# Altium schematic sheet PG12_CURRENT_INTEGRATION.SchDoc: BMU - Current Monitor
size B; Address1: 3511 EDISON WAY; Address2: MENLO PARK, CA, 94025; DocumentNumber: 1; Revision: 4.1; SheetNumber: 7; SheetTotal: 9
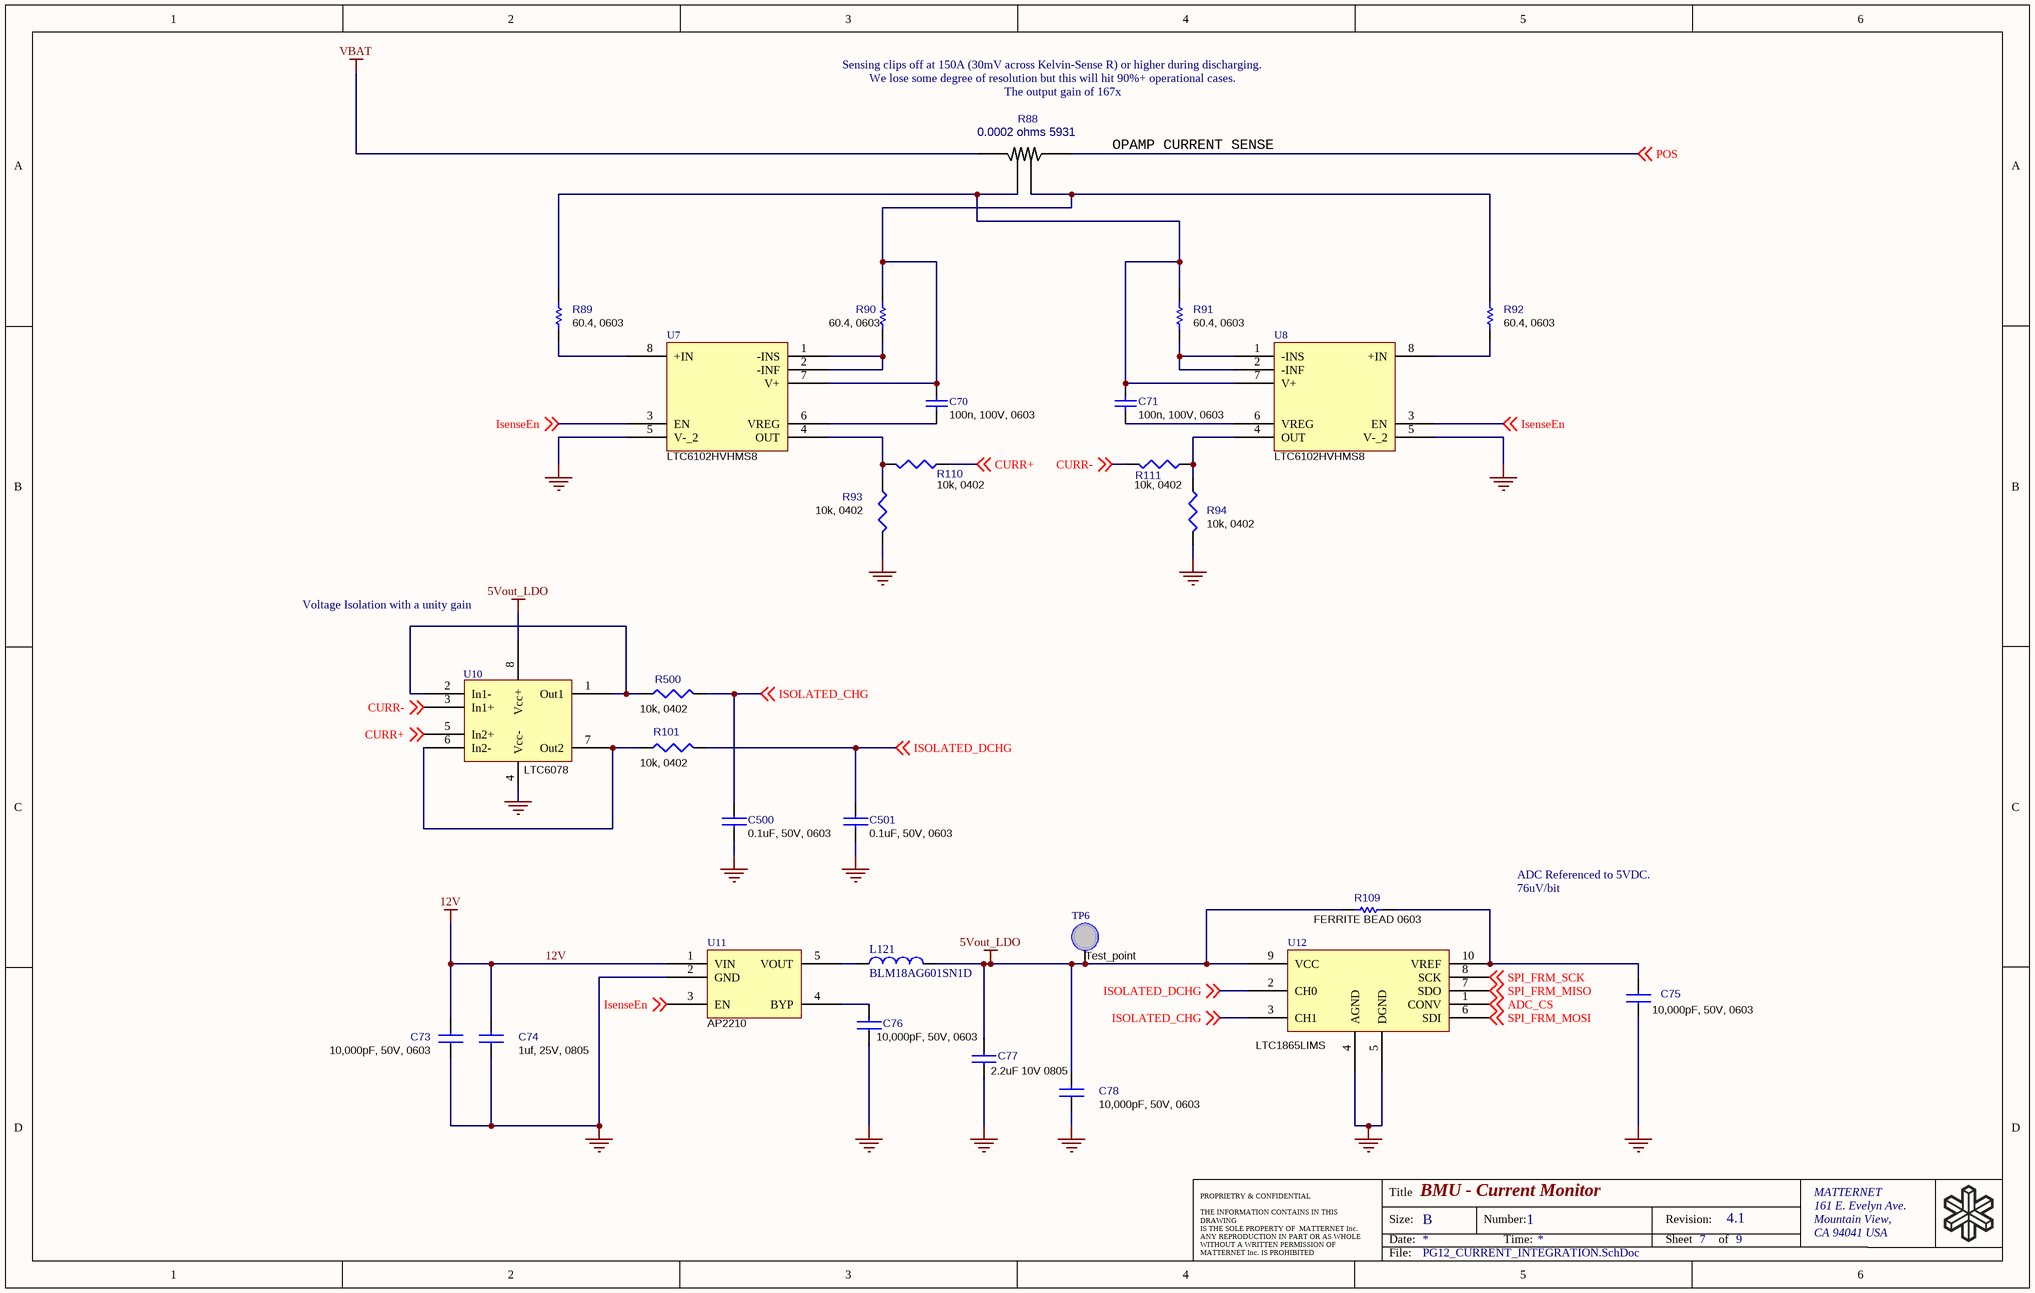
[diagram p0: PG12_CURRENT_INTEGRATION.SchDoc]

## Parts
C70  100n, 100V, 0603  [C0603]
C71  100n, 100V, 0603  [C0603]
C73  10,000pF, 50V, 0603  [C0603]
C74  1uf, 25V, 0805  [C0805]
C75  10,000pF, 50V, 0603  [C0603]
C76  10,000pF, 50V, 0603  [C0603]
C77  2.2uF 10V 0805  [C0805]
C78  10,000pF, 50V, 0603  [C0603]
C500  0.1uF, 50V, 0603  [C0603]
C501  0.1uF, 50V, 0603  [C0603]
L121  BLM18AG601SN1D  [INDC1608X10N]
R88  WSL2512R0700FEA  [R5931]  (value not drawn)
R89  60.4, 0603  [R0603]
R90  60.4, 0603  [R0603]
R91  60.4, 0603  [R0603]
R92  60.4, 0603  [R0603]
R93  10k, 0402  [R0402]
R94  10k, 0402  [R0402]
R101  10k, 0402  [R0402]
R109  FERRITE BEAD 0603  [R0603]
R110  10k, 0402  [R0402]
R111  10k, 0402  [R0402]
R500  10k, 0402  [R0402]
TP6  Test_point  [TP]  (no BOM)
U7  LTC6102HVHMS8  [8MSOP]
U8  LTC6102HVHMS8  [8MSOP]
U10  LTC6078  [8MSOP]
U11  AP2210  [SOT23-5]
U12  LTC1865LIMS  [10-MSOP]

## Nets
5Vout_LDO: C77.2 C78.2 L121.2 R109.2 TP6.1 U10.8(Vcc+) U12.9(VCC)
12V: C73.2 C74.2 U11.1(VIN)
GND: C73.1 C74.1 C75.1 C76.1 C77.1 C78.1 C500.2 C501.2 R93.2 R94.2 U7.5(V-_2) U8.5(V-_2) U10.4(Vcc-) U11.2(GND) U12.4(AGND) U12.5(DGND)
VBAT: R88.1
ADC_CS: U12.1(CONV) ; off-sheet ADC_CS
CURR+: R110.1 U10.5(In2+) ; off-sheet CURR+
CURR-: R111.2 U10.3(In1+) ; off-sheet CURR-
IsenseEn: U7.3(EN) U8.3(EN) U11.3(EN) ; off-sheet IsenseEn
ISOLATED_CHG: C500.1 R500.2 U12.3(CH1) ; off-sheet ISOLATED_CHG
ISOLATED_DCHG: C501.1 R101.2 U12.2(CH0) ; off-sheet ISOLATED_DCHG
POS: R88.2 ; off-sheet POS
SPI_FRM_MISO: U12.7(SDO) ; off-sheet SPI_FRM_MISO
SPI_FRM_MOSI: U12.6(SDI) ; off-sheet SPI_FRM_MOSI
SPI_FRM_SCK: U12.8(SCK) ; off-sheet SPI_FRM_SCK
NetC70_1: C70.1 U7.6(VREG)
NetC70_2: C70.2 R88.4 R90.2 R92.2 U7.7(V+)
NetC71_1: C71.1 U8.6(VREG)
NetC71_2: C71.2 R88.3 R89.2 R91.2 U8.7(V+)
NetC75_2: C75.2 R109.1 U12.10(VREF)
NetC76_2: C76.2 U11.4(BYP)
NetL121_1: L121.1 U11.5(VOUT)
NetR89_1: R89.1 U7.8(+IN)
NetR90_1: R90.1 U7.1(-INS) U7.2(-INF)
NetR91_1: R91.1 U8.1(-INS) U8.2(-INF)
NetR92_1: R92.1 U8.8(+IN)
NetR93_1: R93.1 R110.2 U7.4(OUT)
NetR94_1: R94.1 R111.1 U8.4(OUT)
NetR101_1: R101.1 U10.6(In2-) U10.7(Out2)
NetR500_1: R500.1 U10.1(Out1) U10.2(In1-)

## Notes on the sheet
- Sensing clips off at 150A (30mV across Kelvin-Sense R) or higher during discharging.
- We lose some degree of resolution but this will hit 90%+ operational cases.
- The output gain of 167x
- (near R88) 0.0002 ohms 5931
- OPAMP CURRENT SENSE
- Voltage Isolation with a unity gain
- ADC Referenced to 5VDC.
- 76uV/bit
- Title
- Size:
- Date:
- B
- Number:
- Time:
- Revision:
- Sheet
- of
- MATTERNET
- 161 E. Evelyn Ave.
- Mountain View,
- CA 94041 USA
- PROPRIETRY & CONFIDENTIAL
  THE INFORMATION CONTAINS IN THIS DRAWING
  IS THE SOLE PROPERTY OF  MATTERNET Inc.
  ANY REPRODUCTION IN PART OR AS WHOLE
  WITHOUT A WRITTEN PERMISSION OF
  MATTERNET Inc. IS PROHIBITED
- File:

## Library data of the parts
C70 C71 = Cap: CAP CER 100n 100V X7R 0603; Manufacturer: Murata; Manufacturer Part Number: GCJ188R72A104KA01D; Capacitance: 100nF; Tolerance: 10%; Supplier 1: Digi-Key; Supplier Part Number 1: 490-13420-1-ND; Stock 1: 224293; Pricing 1: 1=0.28, 10=0.189, 100=0.1073, 500=0.07578, 1000=0.0663 (USD); Mount: Surface Mount; Case/Package: 0603; Case Code (Metric): 1608; Case Code (Imperial): 0603; Min Operating Temperature: -55°C; Max Operating Temperature: 125°C; Packaging: Tape and Reel; Voltage Rating: 100V; Features: Soft Termination; Length: 0.063inch; Width: 0.031inch; Thickness: 0.035inch; Ratings: AEC-Q200; Lead Free: Lead Free; Supplier 2: Mouser; Supplier Part Number 2: 81-GCJ188R72A104KA1D; Stock 2: 680575; Pricing 2: 1=0.26, 10=0.173, 50=0.173, 100=0.099, 1000=0.061, 10000=0.05 (USD)
C73 C75 C76 C78 = CAP-Generic-0603: CAP CER 10000PF 50V X7R 0603; Manufacturer: TDK; Manufacturer Part Number: CGA3E2X7R1H103K080AE; Capacitance: 10nF; Tolerance: 10%; Supplier 1: Digi-Key; Supplier Part Number 1: 445-15955-1-ND; Stock 1: 42633; Pricing 1: 1=0.27, 10=0.186, 100=0.0944, 500=0.06458, 1000=0.05713 (USD); Mount: Surface Mount; Case/Package: 0603; Weight: 7.1E-05oz; Case Code (Metric): 1608; Case Code (Imperial): 0603; Min Operating Temperature: -55°C; Max Operating Temperature: 125°C; Package Quantity: 4000; Packaging: Tape and Reel; Voltage Rating: 50V; Dielectric: X7R; Termination: SMD/SMT; Voltage Rating (DC): 50V; Features: Soft Termination; Length: 0.063inch; Height: 0.8mm; Width: 0.031inch; Thickness: 0.035inch; Ratings: AEC-Q200
C74 = CAP-Generic-0402: CAP CER 1UF 25V X7R 0805; Manufacturer: Murata; Manufacturer Part Number: GCJ21BR71E105KA12L; Tolerance: 10%; Supplier 1: Digi-Key; Supplier Part Number 1: 490-5802-1-ND; Stock 1: 116649; Pricing 1: 1=0.48, 10=0.333, 100=0.1997, 500=0.14974, 1000=0.12645 (USD); Mount: Surface Mount; Case/Package: 0805; Case Code (Imperial): 0805; Case Code (Metric): 2012; Min Operating Temperature: -55°C; Max Operating Temperature: 125°C; Capacitance: 1uF; Voltage Rating: 25V; Voltage Rating (DC): 25V; Packaging: Tape and Reel; Package Quantity: 3000; Dielectric: X7R; Termination: SMD/SMT; Features: Soft Termination; Length: 2mm; Width: 1.25mm; Thickness: 0.057inch; Depth: 1.25mm; Ratings: AEC-Q200; Lead Free: Lead Free
C77 = CAP-Generic-0805: CAP CER 2.2UF 10V 10% X7R 0805; Manufacturer: KEMET; Manufacturer Part Number: C0805X225K8RACAUTO; Dielectric Material: Ceramic; Supplier 1: Digi-Key; Supplier Part Number 1: 399-11602-1-ND; Stock 1: 2328; Pricing 1: 1=0.9, 10=0.667, 100=0.4571, 500=0.36184, 1000=0.3047 (USD); Mount: Surface Mount; Case/Package: 0805; Case Code (Metric): 2012; Case Code (Imperial): 0805; Min Operating Temperature: -55°C; Max Operating Temperature: 125°C; Packaging: Tape and Reel; Capacitance: 2.2uF; Voltage Rating: 10V; Tolerance: 10%; Voltage Rating (DC): 10V; Dielectric: X7R; Features: Soft Termination; Length: 0.079inch; Width: 0.049inch; Thickness: 0.055inch; Ratings: AEC-Q200; Supplier 2: Mouser; Supplier Part Number 2: 80-C0805X225K8RAUTO; Stock 2: 4965; Pricing 2: 1=1.06, 10=0.715, 50=0.715, 100=0.446, 1000=0.369, 10000=0.228 (USD)
C500 C501 = CAP-Generic-0603: CAP CER 0.1UF 50V 10% X7R 0603; Manufacturer: Murata; Manufacturer Part Number: GCJ188R71E104KA12D; Supplier 1: Digi-Key; Supplier Part Number 1: 490-16477-1-ND; Stock 1: 2560; Pricing 1: 1=0.22, 10=0.152, 100=0.077, 500=0.0527, 1000=0.04662 (USD); Case/Package: 0603; Supplier 2: Mouser; Supplier Part Number 2: 81-GCJ188R71E104KA2D; Stock 2: 47905; Pricing 2: 1=0.21, 10=0.139, 50=0.139, 100=0.071, 1000=0.043, 10000=0.035 (USD)
L121 = BLM18AG601SN1D: FERRITE BEAD 600 OHM 0603 1LN; ComponentLink1Description: Reference Spec; ComponentLink1URL: https://www.murata.com/en-us/products/productdata/8796738650142/ENFA0003.pdf; Supplier 1: Digi-Key; Supplier 2: Digi-Key; Supplier 3: Mouser; Supplier Part Number 1: 490-1014-1-ND; Supplier Part Number 2: 490-1014-2-ND; Supplier Part Number 3: 81-BLM11A601S
R88 = Res_4Term: RES SMD 200 UOHM 1% 5W 5931; Manufacturer: Vishay Dale; Manufacturer Part Number: WSL5931L2000FEA; Resistance: 0.2mR; Temperature Coefficient: 225ppm/°C; ComponentLink1URL: http://www.farnell.com/datasheets/1678796.pdf; ComponentLink1Description: http://www.farnell.com/datasheets/1678796.pdf; ComponentLink2URL: http://industrial.panasonic.com/www-data/pdf/AOA0000/AOA0000CE1.pdf; ComponentLink2Description: http://industrial.panasonic.com/www-data/pdf/AOA0000/AOA0000CE1.pdf; ComponentLink3URL: http://www.mouser.com/ds/2/315/AOA0000C84-947596.pdf; ComponentLink3Description: http://www.mouser.com/ds/2/315/AOA0000C84-947596.pdf; ComponentLink4URL: https://www.alliedelec.com/m/d/51cd0790071e1666bdb9d00c57fcf960.pdf; ComponentLink4Description: https://www.alliedelec.com/m/d/51cd0790071e1666bdb9d00c57fcf960.pdf; Supplier 1: Digi-Key; Supplier Part Number 1: WSLN-.0002CT-ND; Stock 1: 8569; Pricing 1: 1=2.69, 10=2.382, 25=2.2088, 50=2.079, 100=1.8191, 250=1.55924, 500=1.29938 (USD); Case/Package: 5931; Case Code (Imperial): 5931; Min Operating Temperature: -65°C; Max Operating Temperature: 170°C; Tolerance: 1%; Power Rating: 5W; Package Quantity: 1; Packaging: Tape and Reel; Composition: Metal Element,Metal Strip; Number of Terminations: 2; Termination: SMD/SMT; Max Power Dissipation: 5W; Features: Moisture Resistant; Length: 0.591inch; Height: 0.02inch; Width: 0.305inch; REACH SVHC: Unknown; ComponentLink5URL: http://www.vishay.com/docs/30110/wsl3921.pdf; ComponentLink5Description: http://www.vishay.com/docs/30110/wsl3921.pdf; Supplier 2: Mouser; Supplier Part Number 2: 71-WSL5931L2000FEA; Stock 2: 2674; Pricing 2: 1=2.27, 10=2.27, 50=1.98, 100=1.74, 1000=0.975, 10000=0.975 (USD)
R89-R92 = Res1: RES SMD 60.4 OHM 1% 1/10W 0603; Manufacturer: Vishay; Manufacturer Part Number: CRCW060360R4FKEA; Resistance: 60.4R; Power Rating: 100mW; Temperature Coefficient: 100ppm/°C; Voltage Rating: 75V; Published: 8-Jun-2000; LatestRevisionDate: 17-Jul-2002; LatestRevisionNote: Re-released for DXP Platform.; PackageReference: AXIAL-0.3; Publisher: Altium Limited; PackageDescription: Axial Device, Thru-Hole; 2 Leads; 0.3 in Pin Spacing; Supplier 1: Digi-Key; Supplier Part Number 1: 541-60.4HCT-ND; Stock 1: 0; Pricing 1: 1=0.1, 10=0.042, 100=0.017, 1000=0.00764, 2500=0.00663 (USD); Mount: Surface Mount; Case/Package: 0603; Weight: 7.1E-05oz; Contact Plating: Tin; Case Code (Metric): 1608; Case Code (Imperial): 0603; Min Operating Temperature: -55°C; Max Operating Temperature: 155°C; Tolerance: 1%; Packaging: Tape and Reel; Composition: Thick Film; Package Quantity: 10; Number of Terminations: 2; Military Standard: Not; Termination: SMD/SMT; Max Power Dissipation: 100mW; Features: Automotive AEC-Q200; Voltage Rating (DC): 75V; Working Voltage: 75V; Length: 1.55mm; Height: 0.45mm; Width: 0.033inch; Depth: 0.85mm; Radiation Hardening: No; Lead Free: Lead Free; REACH SVHC: Unknown; ComponentLink1URL: http://www.vishay.com/docs/20035/dcrcwe3.pdf; ComponentLink1Description: http://www.vishay.com/docs/20035/dcrcwe3.pdf; ComponentLink2URL: http://uk.rs-online.com/webdocs/0d98/0900766b80d98afc.pdf; ComponentLink2Description: http://uk.rs-online.com/webdocs/0d98/0900766b80d98afc.pdf; ComponentLink3URL: http://www.mouser.com/ds/2/427/dcrcwe3-109170.pdf; ComponentLink3Description: http://www.mouser.com/ds/2/427/dcrcwe3-109170.pdf; ComponentLink4URL: http://www.alliedelec.com/m/d/0c934d6939ccefa68dbe0b96d821c8cf.pdf; ComponentLink4Description: http://www.alliedelec.com/m/d/0c934d6939ccefa68dbe0b96d821c8cf.pdf; ComponentLink5URL: http://www.farnell.com/datasheets/2046716.pdf; ComponentLink5Description: http://www.farnell.com/datasheets/2046716.pdf; ComponentLink6URL: http://www.farnell.com/datasheets/2111203.pdf; ComponentLink6Description: http://www.farnell.com/datasheets/2111203.pdf; Supplier 2: Mouser; Supplier Part Number 2: 71-CRCW0603-60.4-E3; Stock 2: 6319; Pricing 2: 1=0.1, 10=0.044, 50=0.044, 100=0.026, 1000=0.018, 10000=0.006 (USD)
R93 R94 R101 R110 R111 R500 = R-Generic-0402: RES SMD 10K OHM 1% 1/16W 0402; Manufacturer: Vishay Dale; Manufacturer Part Number: CRCW040210K0FKTD; Resistance: 10kR; Power Rating: 63mW; Voltage Rating: 50V; Temperature Coefficient: 100ppm/°C; ComponentLink1URL: http://www.yageo.com/documents/recent/PYu-RC_Group_51_RoHS_L_9.pdf; ComponentLink1Description: http://www.yageo.com/documents/recent/PYu-RC_Group_51_RoHS_L_9.pdf; ComponentLink2URL: http://www.mouser.com/ds/2/447/PYu-RC0402_51_RoHS_L_6_r-8721.pdf; ComponentLink2Description: http://www.mouser.com/ds/2/447/PYu-RC0402_51_RoHS_L_6_r-8721.pdf; ComponentLink3URL: http://www.farnell.com/datasheets/1018594.pdf; ComponentLink3Description: http://www.farnell.com/datasheets/1018594.pdf; Supplier 1: Digi-Key; Supplier Part Number 1: 541-2955-1-ND; Stock 1: 17223; Pricing 1: 1=0.15, 10=0.132, 100=0.0508, 1000=0.02236, 2500=0.01931, 5000=0.01728 (USD); Mount: Surface Mount; Case/Package: 0402; Number of Pins: 2; Weight: 2.3E-05oz; Case Code (Metric): 1005; Case Code (Imperial): 0402; Contact Plating: Lead,Tin; Min Operating Temperature: -55°C; Max Operating Temperature: 155°C; Tolerance: 1%; Packaging: Tape and Reel; Package Quantity: 10000; Composition: Thick Film; Number of Terminations: 2; Military Standard: Not; Max Power Dissipation: 63mW; Voltage Rating (DC): 50V; Features: Automotive AEC-Q200; Length: 1mm; Height: 0.016inch; Width: 0.02inch; Depth: 0.5mm; Radiation Hardening: No; Lead Free: Contains Lead; REACH SVHC: Unknown; ComponentLink4URL: http://www.vishay.com/docs/20008/dcrcw.pdf?src-supplier=Digi-Key; ComponentLink4Description: http://www.vishay.com/docs/20008/dcrcw.pdf?src-supplier=Digi-Key; ComponentLink5URL: https://www.verical.com/server-webapp/html/getDatasheet?partID=104182&src-supplier=Verical; ComponentLink5Description: https://www.verical.com/server-webapp/html/getDatasheet?partID=104182&src-supplier=Verical; ComponentLink6URL: http://www.vishay.com/docs/20008/dcrcw.pdf?src-supplier=Avnet; ComponentLink6Description: http://www.vishay.com/docs/20008/dcrcw.pdf?src-supplier=Avnet
R109 = Res1: FERRITE BEAD 600 OHM 0603 1LN; Manufacturer: Wurth Electronics; Manufacturer Part Number: 742792651; Tolerance: 25%; Current Rating: 1A; Impedance: 600R; Number of Lines: 1; DC Resistance (DCR): 200mR; Test Frequency: 100MHz; Inductance: 0.36h; Supplier 1: Digi-Key; Supplier Part Number 1: 732-1593-1-ND; Stock 1: 349001; Pricing 1: 1=0.16, 50=0.1572, 100=0.1451, 500=0.13846, 1000=0.13192 (EUR); Mount: Surface Mount; Case/Package: SMD/SMT; Weight: 0.000141oz; Case Code (Metric): 1608; Case Code (Imperial): 0603; Material: Ferrite; Core Material: Ferrite; Min Operating Temperature: -55°C; Max Operating Temperature: 125°C; Package Quantity: 1; Packaging: Tape and Reel; Max Current Rating: 1A; Max DC Current: 1A; Termination: SMD/SMT; Resistance: 200mR; Length: 1.6mm; Height: 0.8mm; Width: 0.8mm; Depth: 0.8mm; REACH SVHC: Unknown; Lead Free: Lead Free; ComponentLink1URL: http://documents.rs-components.com/techlib://itc_doclist_GB.htm?stockno=6694046; ComponentLink1Description: http://documents.rs-components.com/techlib://itc_doclist_GB.htm?stockno=6694046; ComponentLink2URL: http://www.farnell.com/datasheets/1705833.pdf; ComponentLink2Description: http://www.farnell.com/datasheets/1705833.pdf; ComponentLink3URL: https://katalog.we-online.de/pbs/datasheet/742792651.pdf; ComponentLink3Description: https://katalog.we-online.de/pbs/datasheet/742792651.pdf; ComponentLink4URL: http://www.mouser.com/ds/2/445/742792651-538156.pdf; ComponentLink4Description: http://www.mouser.com/ds/2/445/742792651-538156.pdf
U7 U8 = LTC6102HVHMS8: IC OPAMP CURR SENSE 200KHZ 8MSOP; Manufacturer: Analog Devices / Linear Technology; Manufacturer Part Number: LTC6102HMS8-1#PBF; Number of Channels: 1; Nominal Gain Bandwidth Product: 140kHz; Max Supply Voltage: 60V; Min Supply Voltage: 4V; Input Bias Current: 60pA; Input Offset Voltage (Vos): 3uV; Operating Supply Current: 420uA; Output Current per Channel: 1mA; Power Supply Rejection Ratio (PSRR): 120dB; Supplier 1: Digi-Key; Supplier Part Number 1: LTC6102HMS8-1#PBF-ND; Supplier 2: Mouser; Supplier Part Number 2: 584-LTC6102HMS8-1PBF; Stock 1: 1157; Pricing 1: 1=5.15, 25=3.4204, 100=2.8152 (USD); Case/Package: MSOP; Number of Pins: 8; Min Operating Temperature: -40°C; Max Operating Temperature: 125°C; Package Quantity: 50; Packaging: Rail/Tube; Number of Circuits: 1; Gain Bandwidth Product: 200kHz; Number of Elements: 1; Bandwidth: 200kHz; Lead Free: Lead Free; ComponentLink1URL: http://www.linear.com/docs/44087; ComponentLink1Description: http://www.linear.com/docs/44087
U10 = TSV912IQ2T: IC OPAMP GP 750KHZ RRO 8MSOP; Manufacturer: Analog Devices / Linear Technology; Manufacturer Part Number: LTC6078HMS8#TRPBF; Common Mode Rejection Ratio: 91dB; Slew Rate: 0.05V/µs; Max Supply Voltage: 5.5V; Min Supply Voltage: 2.7V; Number of Circuits: 2; Input Bias Current: 0.2pA; Input Offset Voltage (Vos): 7uV; Operating Supply Current: 55uA; Output Current per Channel: 25mA; Voltage Gain: 125dB; Power Supply Rejection Ratio (PSRR): 120dB; Supplier 1: Digi-Key; Supplier Part Number 1: LTC6078HMS8#TRPBFCT-ND; Stock 1: 1466; Pricing 1: 1=4.05, 25=3.6136, 100=2.5704, 250=2.3562 (USD); Case/Package: MSOP; Number of Pins: 8; Min Operating Temperature: -40°C; Max Operating Temperature: 125°C; Package Quantity: 2500; Unity Gain Bandwidth Product: 750kHz; Nominal Gain Bandwidth Product: 750kHz; Packaging: Tape and Reel; Gain Bandwidth Product: 750kHz; Number of Elements: 2; Number of Channels: 2; Lead Free: Lead Free; ComponentLink1URL: http://www.linear.com/docs/9198; ComponentLink1Description: http://www.linear.com/docs/9198
U11 = AP2210K: IC REG LINEAR 5V 300MA SOT23-5; PART NUMBER: AP2210K-5.0TRG1; Manufacturer: Diodes; Number of Outputs: 1; Min Input Voltage: 2.5V; Max Input Voltage: 13.2V; Dropout Voltage: 250mV; Polarity: Positive; Quiescent Current: 150uA; Accuracy: 1%; Power Supply Rejection Ratio (PSRR): 75dB; Output Type: Fixed; Supplier 1: Digi-Key; Supplier Part Number 1: AP2210K-5.0TRG1DICT-ND; Manufacturer Part Number: AP2210K-5.0TRG1; Stock 1: 28886; Pricing 1: 1=0.43, 10=0.349, 100=0.2373, 500=0.17798, 1000=0.13349 (USD); Mount: Surface Mount; Case/Package: SOT-23-5; Number of Pins: 5; Weight: 0.001058oz; Min Operating Temperature: -40°C; Max Operating Temperature: 125°C; Max Output Current: 300mA; Output Voltage: 5V; Package Quantity: 3000; Packaging: Tape and Reel; Output Current: 300mA; Number of Regulators: 1; Lead Free: Lead Free; ComponentLink1URL: https://www.diodes.com/assets/Datasheets/AP2210.pdf; ComponentLink1Description: https://www.diodes.com/assets/Datasheets/AP2210.pdf
U12 = LTC1865: IC A/D CONV 2CH 16BIT 10-MSOP; Manufacturer: Analog Devices / Linear Technology; Manufacturer Part Number: LTC1865LIMS#PBF; Min Supply Voltage: 4.75V; Max Supply Voltage: 5.25V; Interface: Serial,SPI; Max Power Dissipation: 400mW; Number of Bits: 16; Sampling Rate: 150KS/s; Number of Converters: 1; Resolution: 16b; Polarity: Unipolar; Supply Type: Single; Integral Nonlinearity (INL): 8LSB; Nominal Supply Current: 450uA; Supplier 1: Mouser; Supplier Part Number 1: 584-LTC1865LIMS#PBF; Stock 1: 130; Pricing 1: 1=14.38, 10=13.18, 50=9.53, 100=7.96, 1000=7.96, 10000=7.96 (USD); Mount: Surface Mount; Case/Package: MSOP; Number of Pins: 10; Min Operating Temperature: -40°C; Max Operating Temperature: 85°C; Package Quantity: 50; Packaging: Rail/Tube; Number of Elements: 1; Power Dissipation: 400mW; REACH SVHC: No SVHC; Lead Free: Lead Free; ComponentLink1URL: http://www.farnell.com/datasheets/1575726.pdf; ComponentLink1Description: http://www.farnell.com/datasheets/1575726.pdf; ComponentLink2URL: http://www.linear.com/pc/downloadDocument.do?navId=H0,C1,C1155,C1001,C1158,P2259,D1106; ComponentLink2Description: http://www.linear.com/pc/downloadDocument.do?navId=H0,C1,C1155,C1001,C1158,P2259,D1106; Supplier 2: Digi-Key; Supplier Part Number 2: LTC1865LIMS#PBF-ND; Stock 2: 318; Pricing 2: 1=14.35, 25=9.5292, 100=7.956 (USD)